# Altium schematic sheet poweramplifier_schematic.SchDoc
size A
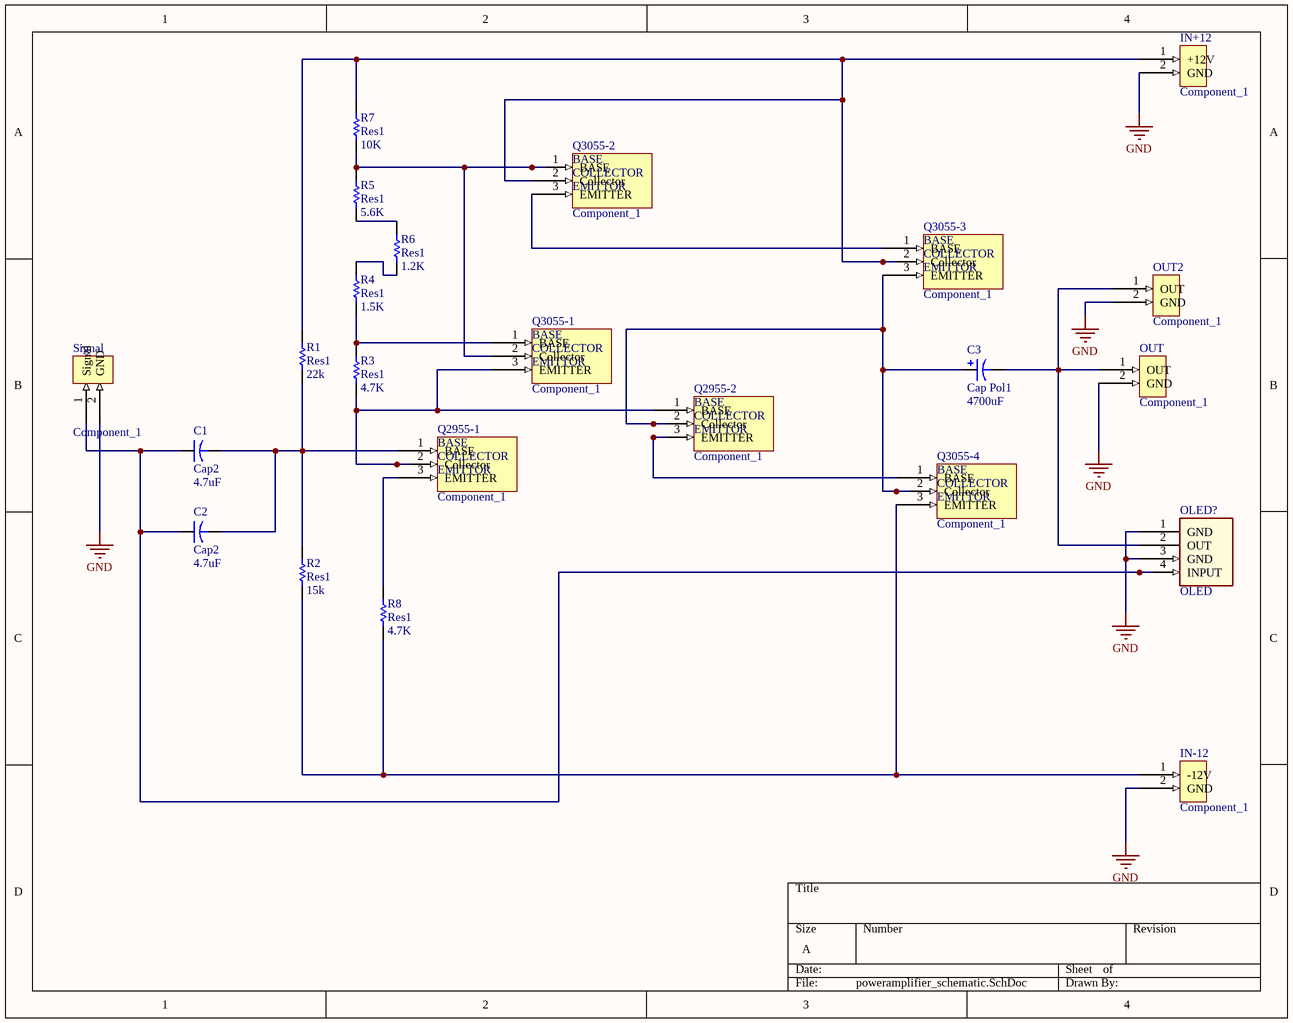
[diagram p0: poweramplifier_schematic.SchDoc]

## Parts
C1  Cap2  value 4.7uF  [CAPR5-4X5]
C2  Cap2  value 4.7uF  [CAPR5-4X5]
C3  Cap Pol1  value 4700uF  [RB7.6-15]
IN+12  Component_1  [ConnectorBlue]
IN-12  Component_1  [ConnectorBlue]
OLED?  OLED  [OLEDHEADER]
OUT  Component_1  [ConnectorBlue]
OUT2  Component_1  [ConnectorBlue]
Q2955-1  Component_1  [TIP2955]
Q2955-2  Component_1  [TIP2955]
Q3055-1  Component_1  [TIP2955]
Q3055-2  Component_1  [TIP2955]
Q3055-3  Component_1  [TIP2955]
Q3055-4  Component_1  [TIP2955]
R1  Res1  value 22k  [AXIAL-0.3]
R2  Res1  value 15k  [AXIAL-0.3]
R3  Res1  value 4.7K  [AXIAL-0.3]
R4  Res1  value 1.5K  [AXIAL-0.3]
R5  Res1  value 5.6K  [AXIAL-0.3]
R6  Res1  value 1.2K  [AXIAL-0.3]
R7  Res1  value 10K  [AXIAL-0.3]
R8  Res1  value 4.7K  [AXIAL-0.3]
Signal  Component_1  [ConnectorBlue]

## Nets
GND: IN+12.2(GND) IN-12.2(GND) OLED?.1(GND) OLED?.3(GND) OUT.2(GND) OUT2.2(GND) Signal.2(GND)
NetC1_1: C1.1 C2.1 OLED?.4(INPUT) Signal.1(Signal)
NetC1_2: C1.2 C2.2 Q2955-1.1(BASE) R1.1 R2.2
NetC3_1: C3.1 Q2955-2.2(Collector) Q3055-3.3(EMITTER) Q3055-4.2(Collector)
NetC3_2: C3.2 OLED?.2(OUT) OUT.1(OUT) OUT2.1(OUT)
NetIN+12_1: IN+12.1(+12V) Q3055-2.2(Collector) Q3055-3.2(Collector) R1.2 R7.2
NetIN-12_1: IN-12.1(-12V) Q3055-4.3(EMITTER) R2.1 R8.1
NetQ2955-1_2: Q2955-1.2(Collector) Q2955-2.1(BASE) Q3055-1.3(EMITTER) R3.1
NetQ2955-1_3: Q2955-1.3(EMITTER) R8.2
NetQ2955-2_3: Q2955-2.3(EMITTER) Q3055-4.1(BASE)
NetQ3055-1_1: Q3055-1.1(BASE) R3.2 R4.1
NetQ3055-1_2: Q3055-1.2(Collector) Q3055-2.1(BASE) R5.2 R7.1
NetQ3055-2_3: Q3055-2.3(EMITTER) Q3055-3.1(BASE)
NetR4_2: R4.2 R6.1
NetR5_1: R5.1 R6.2

## Notes on the sheet
- (in symbol Component_1) COLLECTOR; EMITTOR

## Library data of the parts
C1 C2 = Cap2: Capacitor; Published: 23-Sep-2002; PackageReference: CAPR5-4X5; Publisher: Altium Limited; PackageDescription: Capacitor; 2 Leads
C3 = Cap Pol1: Polarized Capacitor (Radial); Published: 8-Jun-2000; LatestRevisionDate: 17-Jul-2002; LatestRevisionNote: Re-released for DXP Platform.; PackageReference: RB7.6-15; Publisher: Altium Limited; PackageDescription: Polarized Capacitor (Radial); 2 Leads
R1-R8 = Res1: Resistor; Published: 8-Jun-2000; LatestRevisionDate: 17-Jul-2002; LatestRevisionNote: Re-released for DXP Platform.; PackageReference: AXIAL-0.3; Publisher: Altium Limited; PackageDescription: Axial Device, Thru-Hole; 2 Leads; 0.3 in Pin Spacing